# EAGLE design WeMos-RFLink (EAGLE 7.5.0)
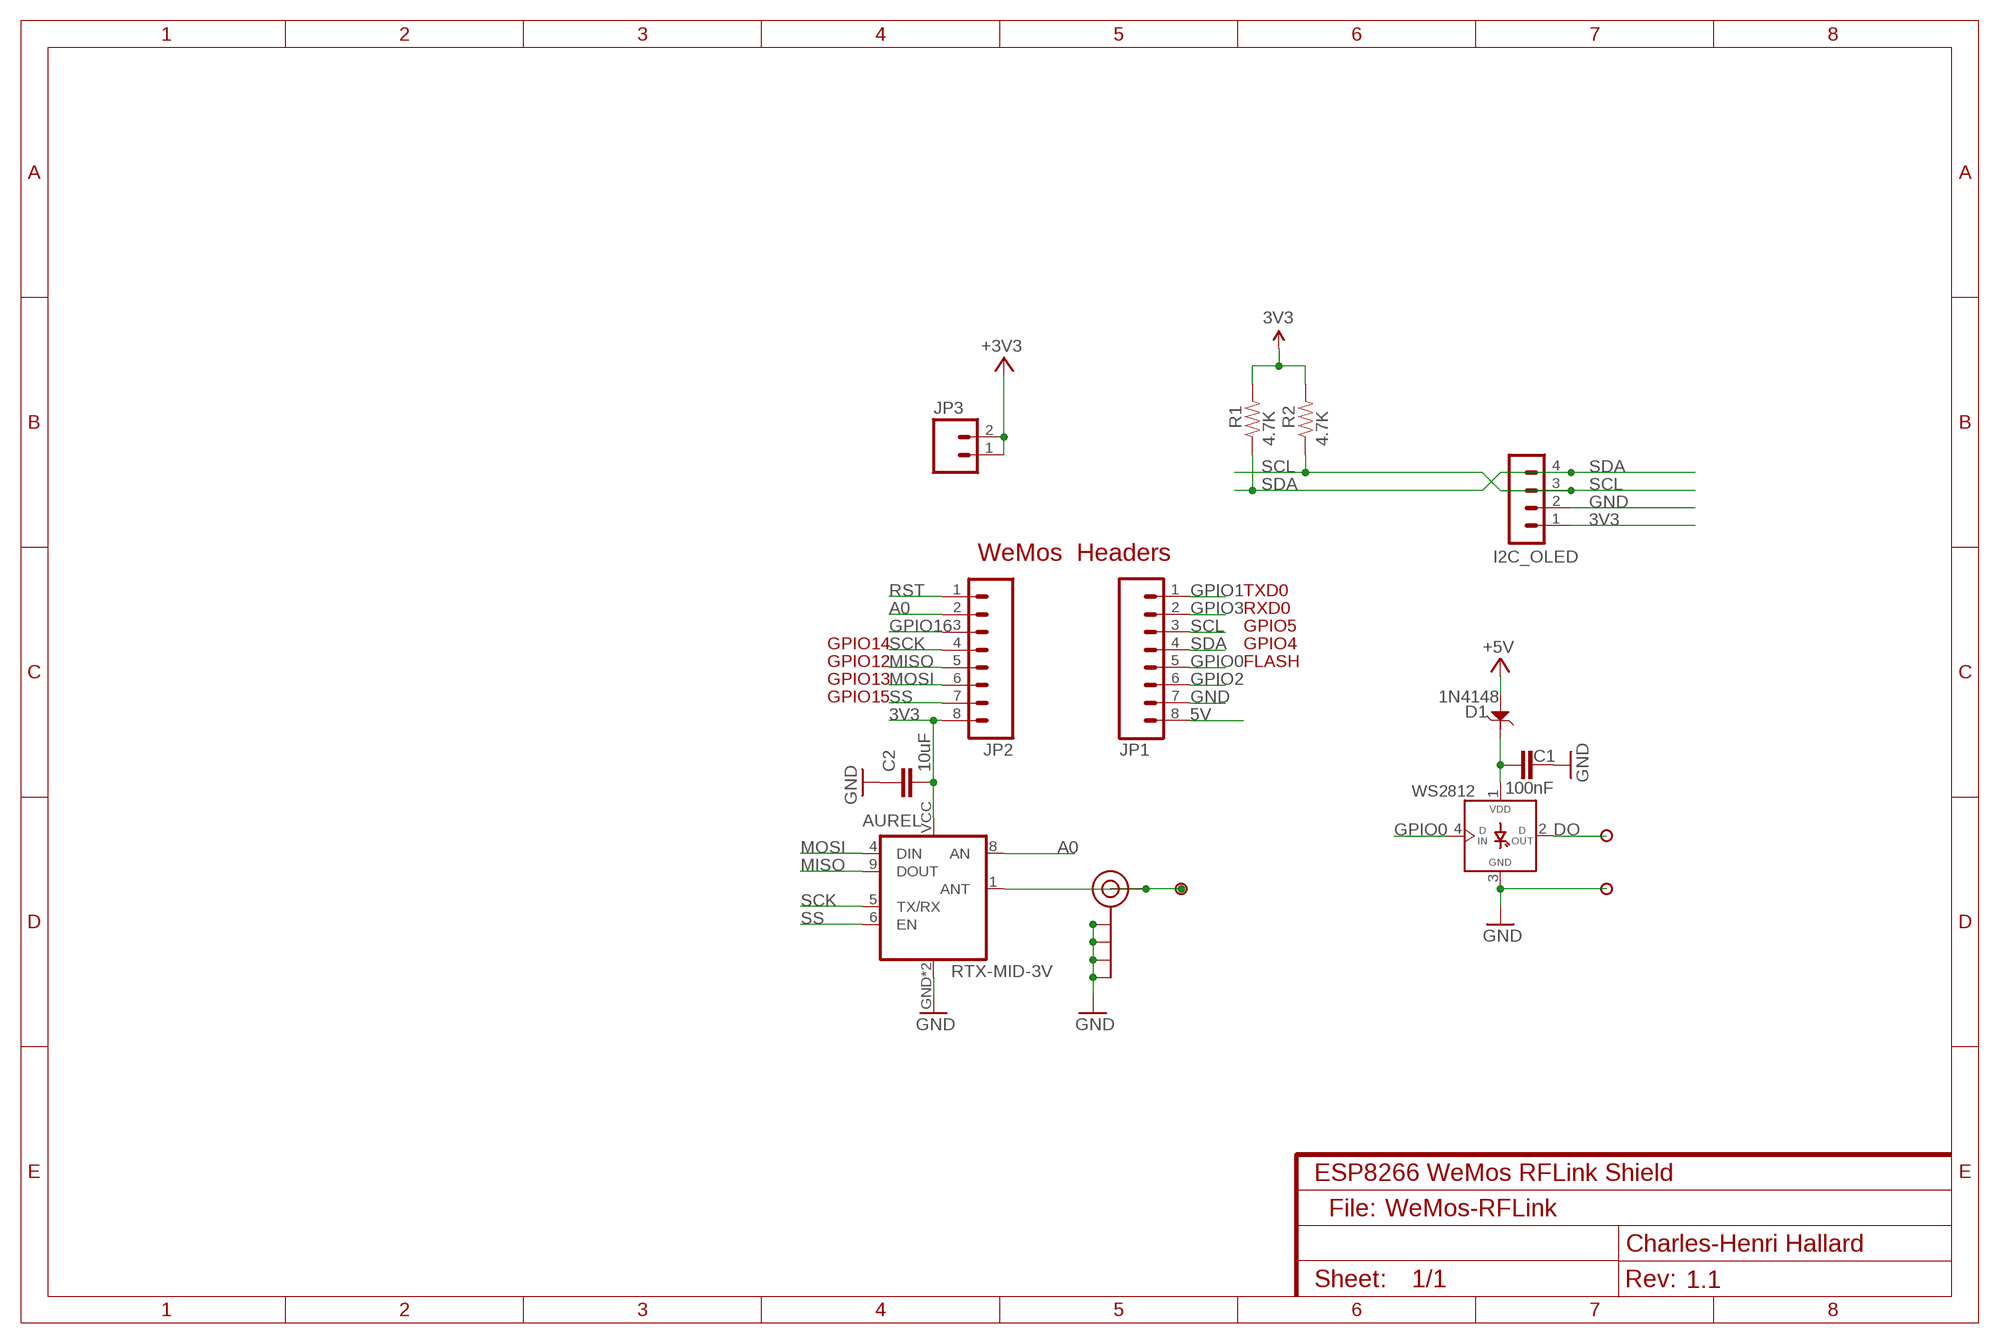
[diagram p0: schematic, sheet 1]
NAME (FRAME-A4L): CNAME: ESP8266 WeMos RFLink Shield; CREVISION: 1.1; DESIGNER: Charles-Henri Hallard

## Parts
AUREL  RTX-MID-3V  RTX-MID  [RTX-MID]
C1  100nF  CAP0805-CAP  [0805-CAP]
C2  10uF  CAP0805-CAP-LARGEPADS  [0805-CAP-LARGEPADS]
D1  1N4148  D-ESD-2P-CESD5V0D1  [SOD123-2.7X1.6]
I2C_OLED  CON_HEADER_1X04'SMALL''  [M1X4]
J$1  SMA_EDGE  [SMA-EDGE]
JP1  M08NO_SILK_FEMALE_PTH  [1X08_NO_SILK]
JP2  M08NO_SILK_FEMALE_PTH  [1X08_NO_SILK]
JP3  M021X02_NO_SILK  [1X02_NO_SILK]
P1  PADSMALL  [PAD-SMALL]
P2  PADNORMAL  [PAD]
P3  PADNORMAL  [PAD]
R1  4.7K  RESISTOR0805-RES  [0805-RES]
R2  4.7K  RESISTOR0805-RES  [0805-RES]
U-FL  U.FL  [U.FL]
WS2812  WS2812B  WS2812BSMD  [WS2812B]

## Nets
3V3: AUREL.VCC C2.2 I2C_OLED.1 JP2.8 JP3.1 JP3.2 R1.2 R2.2 ; supply symbol labelled +3V3
5V: D1.1 JP1.8 ; supply symbol labelled +5V
A0: AUREL.8(AN) JP2.2
ANT: AUREL.1(ANT) J$1.SIG(SIGNAL) P1.1 U-FL.3(SIGNAL)
DO: P2.1 WS2812.2(DOUT)
GND: AUREL.GND AUREL.GND1(GND) C1.2 C2.1 I2C_OLED.2 J$1.GND@0(GND) J$1.GND@1(GND) J$1.GND@2(GND) J$1.GND@3(GND) JP1.7 P3.1 U-FL.1(GND) U-FL.2(GND) WS2812.3(GND)
GPIO0: JP1.5 WS2812.4(DIN)
GPIO1: JP1.1
GPIO2: JP1.6
GPIO3: JP1.2
GPIO16: JP2.3
MISO: AUREL.9(DOUT) JP2.5
MOSI: AUREL.4(DIN) JP2.6
RST: JP2.1
SCK: AUREL.5(TX/RX) JP2.4
SCL: I2C_OLED.3 JP1.3 R2.1
SDA: I2C_OLED.4 JP1.4 R1.1
SS: AUREL.6(EN) JP2.7
VLED: C1.1 D1.2 WS2812.1(VDD)

## Notes on the sheet
- WeMos  Headers
- TXD0
- RXD0
- GPIO5
- GPIO14 | GPIO4
- GPIO12 | FLASH
- GPIO13
- GPIO15
- File:

## Library data of the parts
AUREL = _c2h:RTX-MID
C1 C2 = _c2h:CAP: Capacitor Standard 0603 ceramic capacitor, and 0.1" leaded capacitor.
D1 = Seeed-Discrete:D-ESD-2P: Diodes for Protectiong against ESD
I2C_OLED = _c2h:CON_HEADER_1X04
J$1 = SparkFun-Connectors:SMA_EDGE: SMA Antenna Connector End launch SMA connector. The paste layer has been removed so that the connector can be hand soldered onto the board after reflow.
JP1 JP2 = SparkFun-Connectors:M08: Header 8 Standard 8-pin 0.1" header. Use with straight break away headers (SKU : PRT-00116), right angle break away headers (PRT-00553), swiss pins (PRT-00743), machine pins (PRT-00117), and female headers (PRT-00115).; PROD_ID: CONN-08438
JP3 = SparkFun-Connectors:M02: Standard 2-pin 0.1" header. Use with - straight break away headers ( PRT-00116) - right angle break away headers (PRT-00553) - swiss pins (PRT-00743) - machine pins (PRT-00117) - female headers (PRT-00115) Molex polarized connector foot print use with: PRT-08233 with associated crimp pins and housings. 2.54_SCREWTERM for use with PRT-10571. 3.5mm Screw Terminal footprints for PRT-08084 5mm Screw Terminal footprints for use with PRT-08432
P1 = SteveMarple:PAD
P2 P3 = _c2h:PAD
R1 R2 = _c2h:RESISTOR: Resistor Basic schematic elements and footprints for 0603, 1206, and PTH resistors.
U-FL = microbuilder:U.FL: U.FL Antenna Connector
WS2812 = _c2h:WS2812B

## Net classes
0 default: width 0.203 mm, drill 0.356 mm, clearance 0.152 mm
1 power: width 0.203 mm, clearance 0.152 mm

## Board
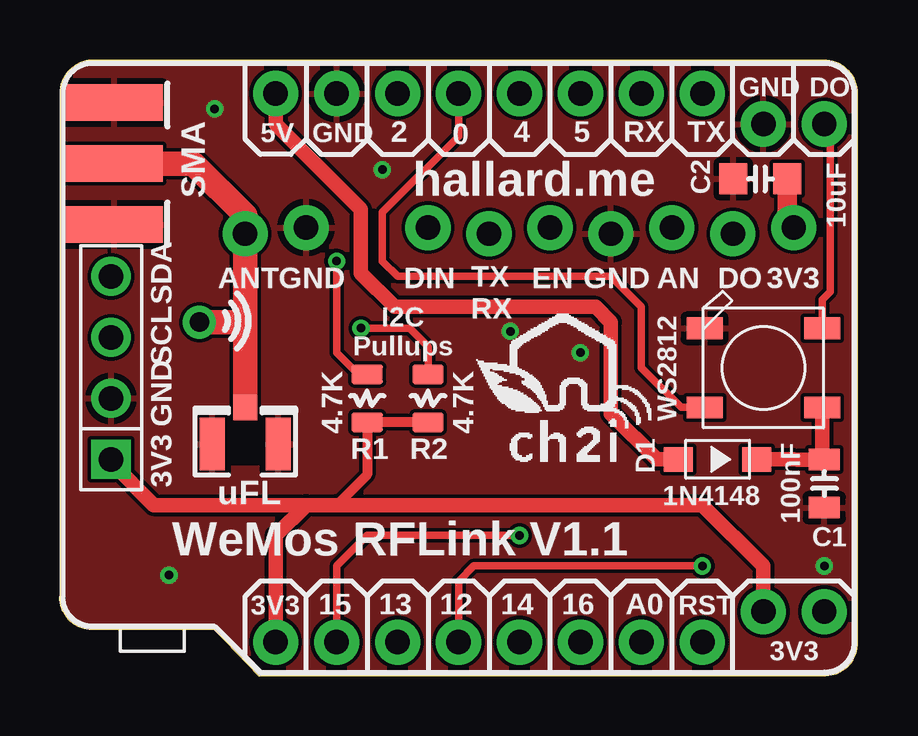
[diagram p1: board, top side]
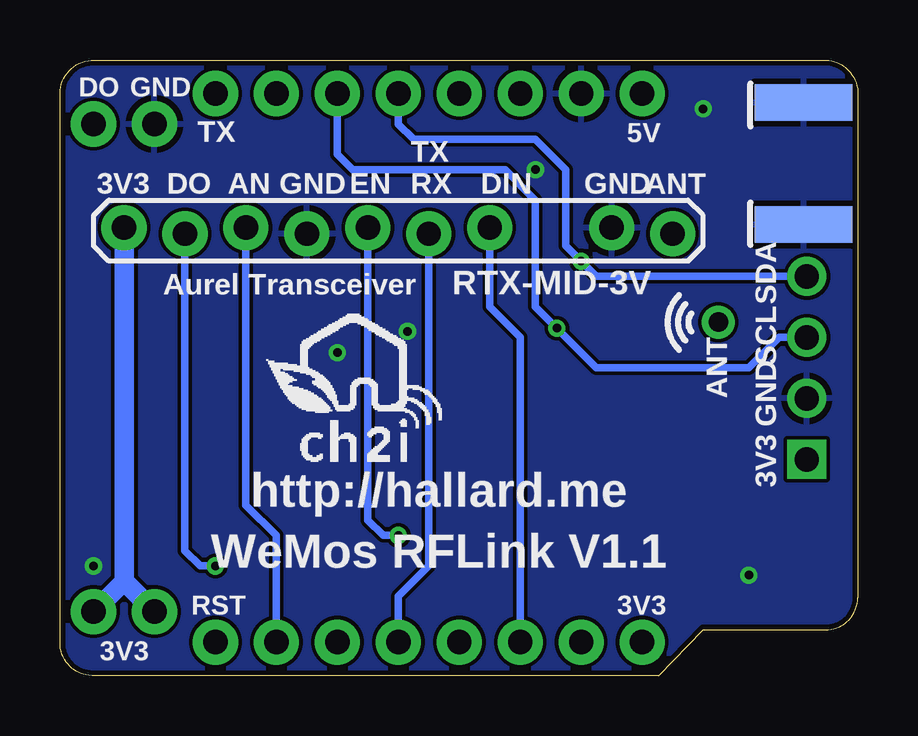
[diagram p2: board, bottom side, seen from below]

Size 33.24 x 25.65 mm. Coordinates in mm from the lower left corner, seen from the top.
Outline: 31.81,25.65 1.33,25.65 arc90 0,24.19 0,3.24 arc90 1.37,1.91 6.45,1.91 8.29,0 31.91,0 arc90 33.24,1.4 33.24,24.26 arc90 31.81,25.65
Copper layers (1*16): Top 0.035mm / dielectric 1.5mm / Bottom 0.035mm
Design rules "ElectroDragon_2layer_DRU_no_angle_20140221": minimum track width 6mil, minimum drill 12mil, track to track 6mil, track to pad 6mil, pad to pad 6mil, via to via 6mil, smd to smd 6mil, copper to edge 8mil, drill to drill 6mil, minimum pad ring 10mil, minimum via ring 6mil, stop-mask expansion 4mil, vias tented up to drill 100mil, thermal gap 10mil

### Footprints (pad centres in the part's own frame; a part is rotated, then mirrored left to right if it is on the bottom)
RTX-MID = drill 1.016 pad 1.88: 1 -11.43,0.127; 4 -3.81,-0.127; 5 -1.27,0.127; 6 1.27,-0.127; 8 6.35,-0.127; 9 8.89,0.127; GND -8.89,-0.127; GND1 3.81,0.127; VCC 11.43,-0.127
0805-CAP = smd 0.902 x 1.3: 1 -1,0; 2 1,0
0805-CAP-LARGEPADS = smd 1.156 x 1.3: 1 -1.127,0; 2 1.127,0
SOD123-2.7X1.6 = smd 1.2 x 1.02: 1 -1.635,0; 2 1.635,0
M1X4 = drill 1.02 pad 1.632 square: 1 -3.81,0 | drill 1.02 pad 1.632: 2 -1.27,0; 3 1.27,0; 4 3.81,0
SMA-EDGE = smd 1.524 x 4.064: GND@0 0,0; GND@1 5.08,0; SIG 2.54,0 | smd 1.524 x 4.064 bottom: GND@2 0,0; GND@3 5.08,0
1X08_NO_SILK = drill 1.016 pad 1.88: 1 0,0; 2 2.54,0; 3 5.08,0; 4 7.62,0; 5 10.16,0; 6 12.7,0; 7 15.24,0; 8 17.78,0
1X02_NO_SILK = drill 1.016 pad 1.88: 1 0,0; 2 2.54,0
PAD-SMALL = drill 0.813 pad 1.372: 1 0,0
PAD = drill 1.016 pad 1.88: 1 0,0
0805-RES = smd 0.8 x 1.3: 1 -1,0; 2 1,0
U.FL = smd 2.2 x 1.05: 1 0,1.375; 2 0,-1.375 | smd 1.05 x 1: 3 1.525,0
WS2812B = smd 1.5 x 0.9: 1 2.45,-1.65; 2 2.45,1.65; 3 -2.45,1.65; 4 -2.45,-1.65

### Placement (x,y rotation side)
AUREL  19.15,18.54 180 bottom
C1  31.85,8 270 top
C2  29.18,20.7 0 top
D1  27.4,9.02 0 top
I2C_OLED  2.13,12.83 90 top
J$1  2.25,18.8 90 top
JP1  26.77,24.26 180 top
JP2  26.77,1.4 180 top
JP3  29.31,2.67 0 top
P1  5.81,14.73 0 top
P2  31.85,22.99 0 top
P3  29.31,22.99 0 top
R1  12.8,11.56 270 top
R2  15.34,11.56 270 top
U$1  [LOGO_CH2I_75MM]  21.43,10.92 0 top
U$2  [LOGO_CH2I_75MM]  20.54,10.92 0 bottom
U-FL  7.72,9.65 90 top
WS2812  29.31,12.83 0 top

### Tracks (layer width: path | path; a pad name or v marks a point on that pad's centre or on a via)
3V3
  Top 0.406: 11.53,7.11 12.8,8.38 R1.2 R2.2
  Top 0.61: JP3.1 29.31,4.57 26.77,7.11 11.53,7.11 10.26,7.11 | JP2.8 8.99,5.84 10.26,7.11 | I2C_OLED.1 2.13,8.89 3.91,7.11 10.26,7.11
  Top 0.813: C2.2 30.31,18.94 AUREL.VCC
  Bottom 0.813: 30.58,3.94 JP3.2 | JP3.1 30.58,3.94 | AUREL.VCC 30.58,3.94
5V
  Top 0.61: JP1.8 8.99,22.99 12.54,19.43 12.54,16.76 13.94,15.37 22.32,15.37 22.96,14.73 22.96,10.92 24.86,9.02 D1.1
A0
  Bottom 0.305: AUREL.8 25.5,7.11 24.23,5.84 JP2.2
ANT
  Top 0.813: 7.72,19.18 AUREL.1
  Top 1.016: 7.72,19.18 5.56,21.34 J$1.SIG | AUREL.1 7.72,14.73 | 7.72,14.73 U-FL.3 | P1.1 7.72,14.73
DO
  Top 0.305: WS2812.2 31.76,15.66 32.1,16 32.1,22.73 P2.1
GND  (via drill 0.36 pad 0.71)
  other vias: 6.45,23.62 4.54,4.19 18.76,14.35 13.43,21.08 21.69,13.46 31.85,4.57
  pour Bottom: 34.39,26.8 34.39,-1.14 -1.17,-1.14 -1.17,26.8
  pour Top: -0.54,26.16 33.75,26.16 33.75,-0.51 -0.54,-0.51
GPIO0
  Top 0.305: JP1.5 16.61,22.48 13.43,19.3 13.43,17.27 14.07,16.64 22.96,16.64 24.23,15.37 24.23,12.83 25.88,11.18 WS2812.4
MISO  (via drill 0.36 pad 0.71)
  Top 0.305: JP2.5 16.61,3.94 17.24,4.57 v26.77,4.57
  Bottom 0.305: v26.77,4.57 27.4,4.57 28.04,5.21 AUREL.9
MOSI
  Bottom 0.305: JP2.6 14.07,14.1 15.34,15.37 AUREL.4
SCK
  Bottom 0.305: JP2.4 19.15,3.3 17.88,4.57 AUREL.5
SCL  (via drill 0.36 pad 0.71)
  Top 0.305: R2.1 15.34,13.72 14.57,14.48 v12.54,14.48
  Bottom 0.305: JP1.3 21.69,21.72 21.05,21.08 14.7,21.08 13.43,19.81 13.43,15.37 v12.54,14.48 10.89,12.83 4.54,12.83 3.27,14.1 I2C_OLED.3
SDA  (via drill 0.36 pad 0.71)
  Top 0.305: R1.1 12.43,12.56 11.53,13.46 v11.53,17.27
  Bottom 0.305: JP1.4 19.15,22.99 18.51,22.35 13.43,22.35 12.16,21.08 12.16,17.91 v11.53,17.27 10.89,16.64 I2C_OLED.4
SS  (via drill 0.36 pad 0.71)
  Top 0.305: JP2.7 11.53,4.57 12.8,5.84 v19.15,5.84
  Bottom 0.305: AUREL.6 20.42,6.48 19.78,5.84 v19.15,5.84
VLED
  Top 0.61: D1.2 30.58,9.02 30.72,9 C1.1 31.76,8.84 WS2812.1

### Text on the board
tPlace: SMA | uFL
tNames: GND | DO | 5V | GND | 2 | 0 | 4 | 5 | RX | TX | hallard.me | ANT | GND | DIN | EN | GND | AN | DO | 3V3 | SDA | TX / RX | I2C / Pullups | SCL | GND | 3V3 | WeMos RFLink V1.1 | 3V3 | 15 | 13 | 12 | 14 | 16 | A0 | RST | 3V3
bNames: GND | DO | 5V | TX | ANT | GND | DIN | TX / RX | EN | GND | AN | DO | 3V3 | Aurel Transceiver | SDA | SCL | ANT | GND | 3V3 | http://hallard.me | WeMos RFLink V1.1 | 3V3 | RST | 3V3